# EAGLE design board (EAGLE 7.4.0)
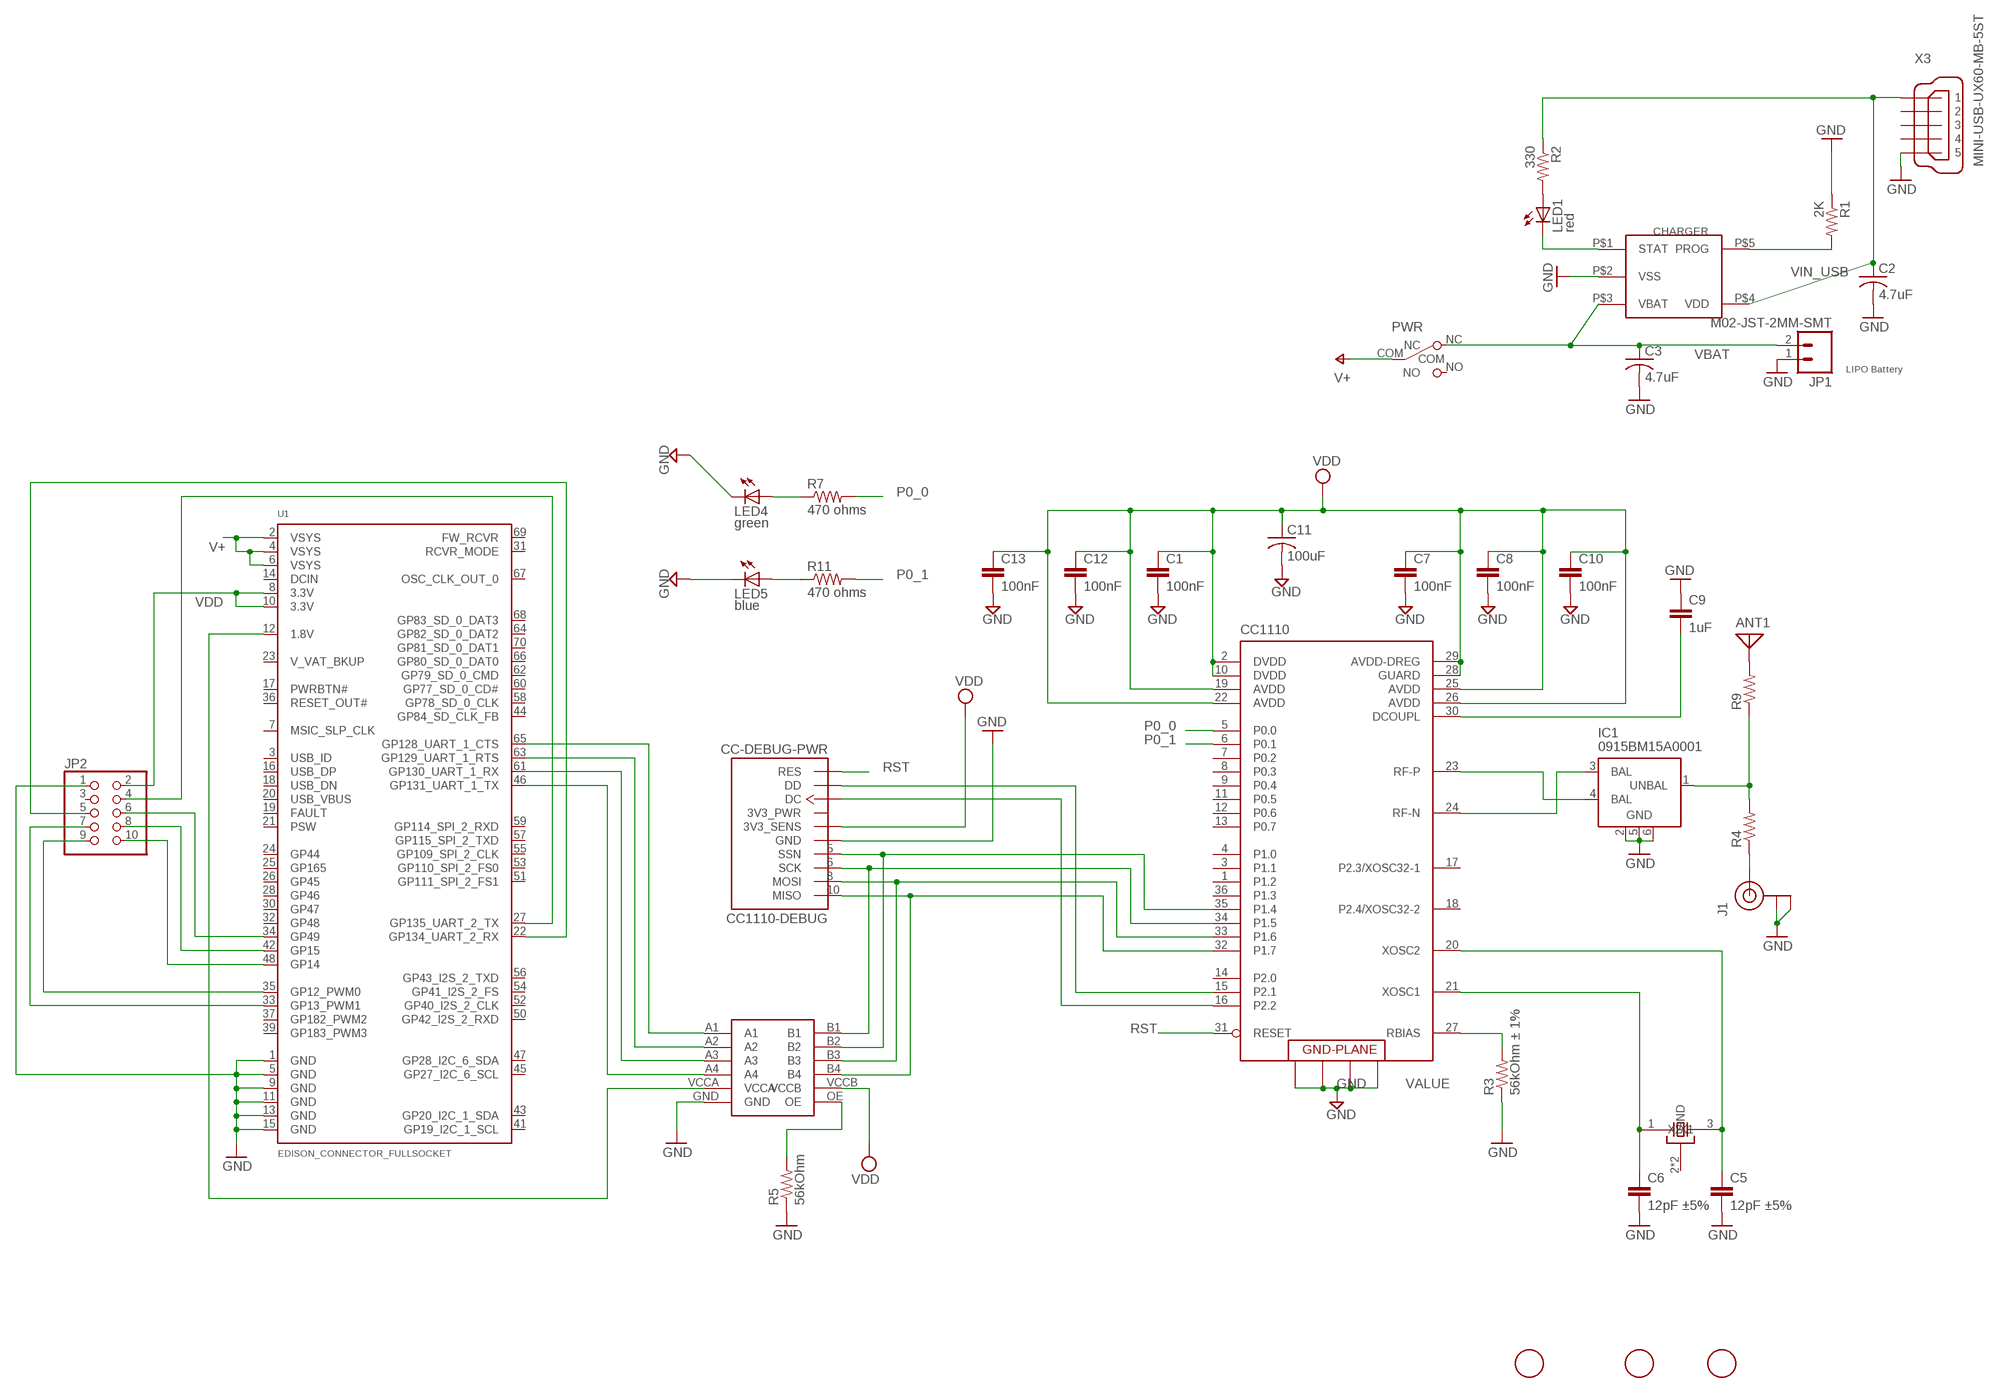
[diagram p0: schematic, sheet 1]

## Parts
ANT1  ANTENNA  [PAD-01]
C1  100nF  C-EUC0402  [C0402]
C2  4.7uF  C-USC0603K  [C0603K]
C3  4.7uF  C-USC0603K  [C0603K]
C5  12pF ±5%  C-EUC0402K  [C0402K]
C6  12pF ±5%  C-EUC0402K  [C0402K]
C7  100nF  C-EUC0402  [C0402]
C8  100nF  C-EUC0402  [C0402]
C9  1uF  C-EUC0402K  [C0402K]
C10  100nF  C-EUC0402  [C0402]
C11  100uF  C-USC0805K  [C0805K]
C12  100nF  C-EUC0402  [C0402]
C13  100nF  C-EUC0402  [C0402]
CC1110  CC1110  [QLP-36_UPDATE]
CC1110-DEBUG  CC-DEBUG-PWR  [CC-P05]
CHARGER  MCP73831  [5PIN_SOT23]
FID1  FIDUCIAL  [FIDUCIAL_1MM]
FID2  FIDUCIAL  [FIDUCIAL_1MM]
FID3  FIDUCIAL  [FIDUCIAL_1MM]
IC1  0915BM15A0001  [0915BM15A0001]
J1  U.FL  [U.FL]
JP1  M02-JST-2MM-SMT  [JST-2-SMD]
JP2  PINHD-2X5  [2X05]
LED1  red  LEDSML0603  [SML0603]
LED4  green  LEDSML0603  [SML0603]
LED5  blue  LEDSML0603  [SML0603]
PWR  SW_SLIDE  [SLIDE_SWITCH_SMD]
R1  2K  R-US_R0402  [R0402]
R2  330  R-US_R0402  [R0402]
R3  56kOhm ± 1%  R-US_R0402  [R0402]
R4  R-US_R0402  [R0402]
R5  56kOhm  R-US_R0402  [R0402]
R7  470 ohms  R-US_R0402  [R0402]
R9  R-US_R0402  [R0402]
R11  470 ohms  R-US_R0402  [R0402]
U1  EDISON_CONNECTOR_FULLSOCKET  [DF40-XC-(X.X)-70DS-0.4V(51)]
U$1  TXB0104  [VQFN-N14]
X1  24MHz 8pF 10ppm -20C +70C  CTS_32X25_SMD  [CTS_32X25]
X3  MINI-USB-UX60-MB-5ST  [UX60-MB-5ST]

## Nets
DC: CC1110-DEBUG.3(DC) CC1110.16(P2.2)
DD: CC1110-DEBUG.4(DD) CC1110.15(P2.1)
GND: C1.2 C2.2 C3.2 C5.2 C6.2 C7.2 C8.2 C9.1 C10.2 C11.2 C12.2 C13.2 CC1110-DEBUG.1(GND) CC1110.37(GND) CC1110.38(GND) CC1110.39(GND) CC1110.40(GND) CHARGER.P$2(VSS) IC1.2(GND) IC1.5(GND) IC1.6(GND) J1.P$1(GND) J1.P$2(GND) JP1.1 JP2.1 LED4.C LED5.C R1.1 R3.1 R5.1 U1.1(GND) U1.5(GND) U1.9(GND) U1.11(GND) U1.13(GND) U1.15(GND) U$1.GND X3.5
MISO: CC1110-DEBUG.10(MISO) CC1110.32(P1.7) U$1.B4
MOSI: CC1110-DEBUG.8(MOSI) CC1110.33(P1.6) U$1.B3
N$1: U1.46(GP131_UART_1_TX) U$1.A4
N$2: CHARGER.P$1(STAT) LED1.C
N$3: CHARGER.P$5(PROG) R1.2
N$4: LED1.A R2.2
N$5: CC1110.24(RF-N) IC1.3(BAL)
N$6: U1.61(GP130_UART_1_RX) U$1.A3
N$7: CC1110.23(RF-P) IC1.4(BAL)
N$9: J1.P$3(SIGNAL) R4.1
N$10: IC1.1(UNBAL) R4.2 R9.1
N$11: U1.63(GP129_UART_1_RTS) U$1.A2
N$12: ANT1.1 R9.2
N$13: U1.65(GP128_UART_1_CTS) U$1.A1
N$14: CC1110.27(RBIAS) R3.2
N$15: U1.12(1.8V) U$1.VCCA
N$16: R5.2 U$1.OE
N$17: JP2.9 U1.35(GP12_PWM0)
N$18: C9.2 CC1110.30(DCOUPL)
N$19: JP2.7 U1.33(GP13_PWM1)
N$20: C6.1 CC1110.21(XOSC1) X1.1(X1)
N$21: C5.1 CC1110.20(XOSC2) X1.3(X2)
N$22: JP2.10 U1.48(GP14)
N$23: JP2.8 U1.42(GP15)
N$24: LED4.A R7.1
N$25: LED5.A R11.1
N$26: JP2.6 U1.34(GP49)
N$27: JP2.4 U1.27(GP135_UART_2_TX)
N$28: JP2.5 U1.22(GP134_UART_2_RX)
P0_0: CC1110.5(P0.0) R7.2
P0_1: CC1110.6(P0.1) R11.2
RST: CC1110-DEBUG.7(RES) CC1110.31(RESET)
SCK: CC1110-DEBUG.6(SCK) CC1110.34(P1.5) U$1.B1
SSN: CC1110-DEBUG.5(SSN) CC1110.35(P1.4) U$1.B2
V+: PWR.COM U1.2(VSYS) U1.4(VSYS) U1.6(VSYS)
VBAT: C3.1 CHARGER.P$3(VBAT) JP1.2 PWR.NC
VDD: C1.1 C7.1 C8.1 C10.1 C11.1 C12.1 C13.1 CC1110-DEBUG.2(3V3_SENS) CC1110.2(DVDD) CC1110.10(DVDD) CC1110.19(AVDD) CC1110.22(AVDD) CC1110.25(AVDD) CC1110.26(AVDD) CC1110.28(GUARD) CC1110.29(AVDD-DREG) JP2.2 U1.8(3.3V) U1.10(3.3V) U$1.VCCB
VIN_USB: C2.1 CHARGER.P$4(VDD) R2.1 X3.1
Unconnected: CC1110-DEBUG.9(3V3_PWR) CC1110.1(P1.2) CC1110.3(P1.1) CC1110.4(P1.0) CC1110.7(P0.2) CC1110.8(P0.3) CC1110.9(P0.4) CC1110.11(P0.5) CC1110.12(P0.6) CC1110.13(P0.7) CC1110.14(P2.0) CC1110.17(P2.3/XOSC32-1) CC1110.18(P2.4/XOSC32-2) CC1110.36(P1.3) JP2.3 PWR.NO U1.3(USB_ID) U1.7(MSIC_SLP_CLK) U1.14(DCIN) U1.16(USB_DP) U1.17(PWRBTN#) U1.18(USB_DN) U1.19(FAULT) U1.20(USB_VBUS) U1.21(PSW) U1.23(V_VAT_BKUP) U1.24(GP44) U1.25(GP165) U1.26(GP45) U1.28(GP46) U1.30(GP47) U1.31(RCVR_MODE) U1.32(GP48) U1.36(RESET_OUT#) U1.37(GP182_PWM2) U1.39(GP183_PWM3) U1.41(GP19_I2C_1_SCL) U1.43(GP20_I2C_1_SDA) U1.44(GP84_SD_CLK_FB) U1.45(GP27_I2C_6_SCL) U1.47(GP28_I2C_6_SDA) U1.50(GP42_I2S_2_RXD) U1.51(GP111_SPI_2_FS1) U1.52(GP40_I2S_2_CLK) U1.53(GP110_SPI_2_FS0) U1.54(GP41_I2S_2_FS) U1.55(GP109_SPI_2_CLK) U1.56(GP43_I2S_2_TXD) U1.57(GP115_SPI_2_TXD) U1.58(GP78_SD_0_CLK) U1.59(GP114_SPI_2_RXD) U1.60(GP77_SD_0_CD#) U1.62(GP79_SD_0_CMD) U1.64(GP82_SD_0_DAT2) U1.66(GP80_SD_0_DAT0) U1.67(OSC_CLK_OUT_0) U1.68(GP83_SD_0_DAT3) U1.69(FW_RCVR) U1.70(GP81_SD_0_DAT1) X3.2 X3.3 X3.4

## Notes on the sheet
- LIPO Battery

## Power pins joined to a net without a drawn wire
GND: X1.2(GND) X1.4(GND)

## Library data of the parts
ANT1 = discrete:ANTENNA: Antenna
C1 C5-C10 C12 C13 = rcl:C-EU: CAPACITOR
C2 C3 C11 = rcl:C-US: CAPACITOR, American symbol
CC1110 = parts:CC1110: True System-on-Chip with Low Power RF Transceiver and 8051 MCU
CC1110-DEBUG = parts:CC-DEBUG-PWR: CC debugger connection with various form factors. 2x5-pin 0.05" pitch header include Pin 9 (VDD) supply connection as separate pin. https://github.com/jrowberg/sf-oshw Last updated 2014-01-04 by Jeff Rowberg <jeff@rowberg.net>
CHARGER = parts:MCP73831: Digikey No:- __MCP73831T-2ACI/OTCT-ND__
FID1-FID3 = adafruit:FIDUCIAL: For use by pick and place machines to calibrate the vision/machine, 1mm By microbuilder.eu
IC1 = parts:0915BM15A0001: 915 MHz Impedance Matched Balun-Filter For TI CC11xx Chipset family Data sheet <http://www.johansontechnology.com/datasheets/chipset-specific/0915BM15A0001.pdf>
J1 = SparkFun-Connectors:U.FL: SMD antenna connector- WRL-09144; PROD_ID: CONN-09193
JP1 = SparkFun-Connectors:M02: Standard 2-pin 0.1" header. Use with - straight break away headers ( PRT-00116) - right angle break away headers (PRT-00553) - swiss pins (PRT-00743) - machine pins (PRT-00117) - female headers (PRT-00115) Molex polarized connector foot print use with: PRT-08233 with associated crimp pins and housings. 2.54_SCREWTERM for use with PRT-10571. 3.5mm Screw Terminal footprints for PRT-08084 5mm Screw Terminal footprints for use with PRT-08432; PROD_ID: CONN-08352
JP2 = pinhead:PINHD-2X5: PIN HEADER
LED1 LED4 LED5 = led:LED: LED OSRAM: - CHIPLED LG R971, LG N971, LY N971, LG Q971, LY Q971, LO R971, LY R971 LH N974, LH R974 LS Q976, LO Q976, LY Q976 LO Q996 - Hyper CHIPLED LW Q18S LB Q993, LB Q99A, LB R99A - SideLED LS A670, LO A670, LY A670, LG A670, LP A670 LB A673, LV A673, LT A673, LW A673 LH A674 LY A675 LS A676, LA A676, LO A676, LY A676, LW A676 LS A679, LY A679, LG A679 - Hyper Micro SIDELED® LS Y876, LA Y876, LO Y876, LY Y876 LT Y87S - SmartLED LW L88C, LW L88S LB L89C, LB L89S, LG L890 LS L89K, LO L89K, LY L89K LS L896, LA L896, LO L896, LY L896 - TOPLED LS T670, LO T670, LY T670, LG T670, LP T670 LSG T670, LSP T670, LSY T670, LOP T670, LYG T670 LG T671, LOG T671, LSG T671 LB T673, LV T673, LT T673, LW T673 LH T674 LS T676, LA T676, LO T676, LY T676, LB T676, LH T676, LSB T676, LW T676 LB T67C, LV T67C, LT T67C, LS T67K, LO T67K, LY T67K, LW E67C LS E67B, LA E67B, LO E67B, LY E67B, LB E67C, LV E67C, LT E67C LW T67C LS T679, LY T679, LG T679 LS T770, LO T770, LY T770, LG T770, LP T770 LB T773, LV T773, LT T773, LW T773 LH T774 LS E675, LA E675, LY E675, LS T675 LS T776, LA T776, LO T776, LY T776, LB T776 LHGB T686 LT T68C, LB T68C - Hyper Mini TOPLED® LB M676 - Mini TOPLED Santana® LG M470 LS M47K, LO M47K, LY M47K Source: http://www.osram.convergy.de LUXEON: - LUMILED® LXK2-PW12-R00, LXK2-PW12-S00, LXK2-PW14-U00, LXK2-PW14-V00 LXK2-PM12-R00, LXK2-PM12-S00, LXK2-PM14-U00 LXK2-PE12-Q00, LXK2-PE12-R00, LXK2-PE12-S00, LXK2-PE14-T00, LXK2-PE14-U00 LXK2-PB12-K00, LXK2-PB12-L00, LXK2-PB12-M00, LXK2-PB14-N00, LXK2-PB14-P00, LXK2-PB14-Q00 LXK2-PR12-L00, LXK2-PR12-M00, LXK2-PR14-Q00, LXK2-PR14-R00 LXK2-PD12-Q00, LXK2-PD12-R00, LXK2-PD12-S00 LXK2-PH12-R00, LXK2-PH12-S00 LXK2-PL12-P00, LXK2-PL12-Q00, LXK2-PL12-R00 Source: www.luxeon.com KINGBRIGHT: KA-3528ASYC Source: www.kingbright.com
PWR = parts:SW_SLIDE
R1-R5 R7 R9 R11 = rcl:R-US_: RESISTOR
U1 = Edison:EDISON_CONNECTOR_FULL
U$1 = riled_up_parts:TXB0104
X1 = cts_crystal:CTS_32X25_SMD
X3 = con-hirose:MINI-USB-: MINI USB Connector Source: http://www.hirose.co.jp/cataloge_hp/e24000019.pdf; OC_FARNELL: unknown; OC_NEWARK: unknown

## Board
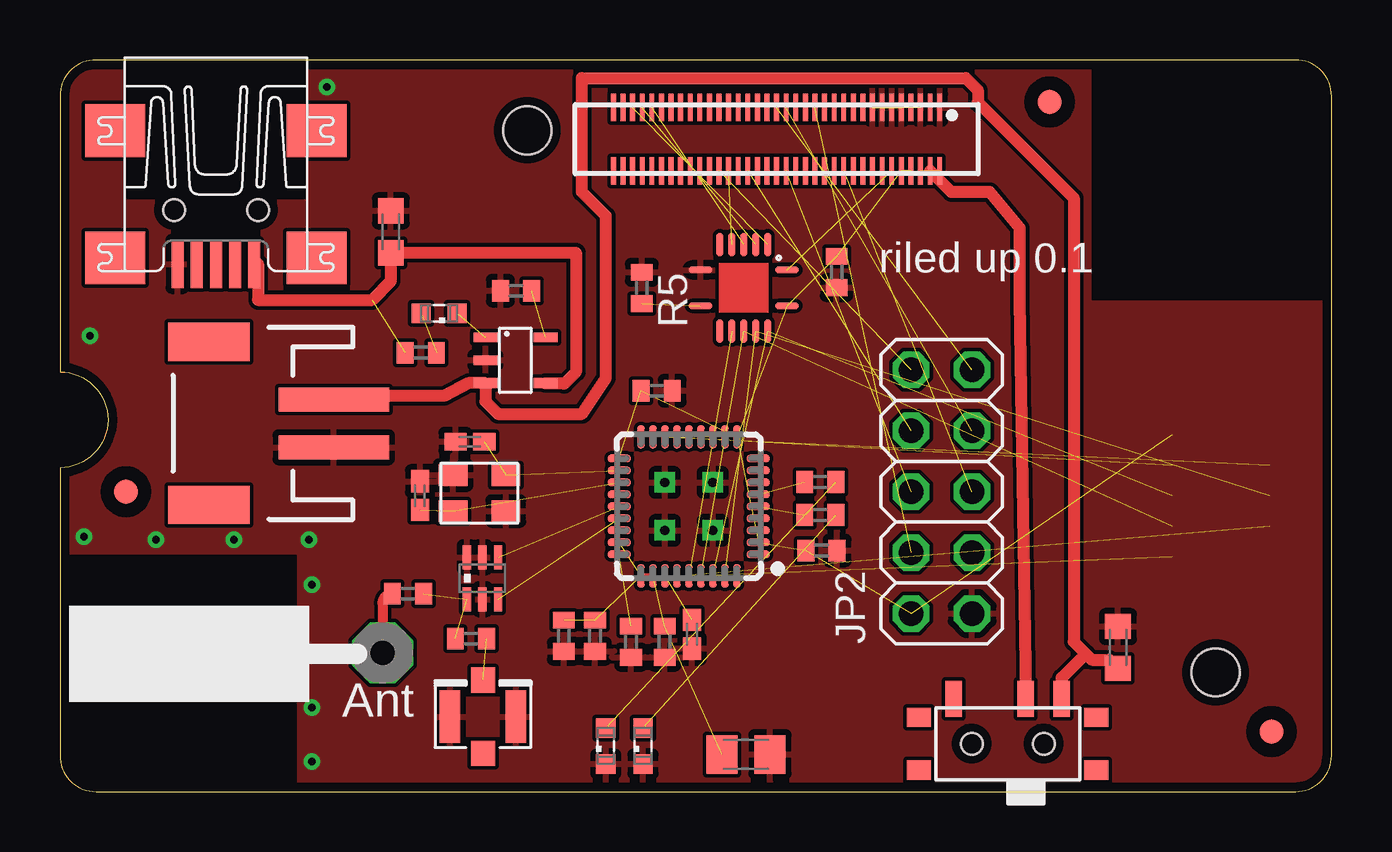
[diagram p1: board, top side]
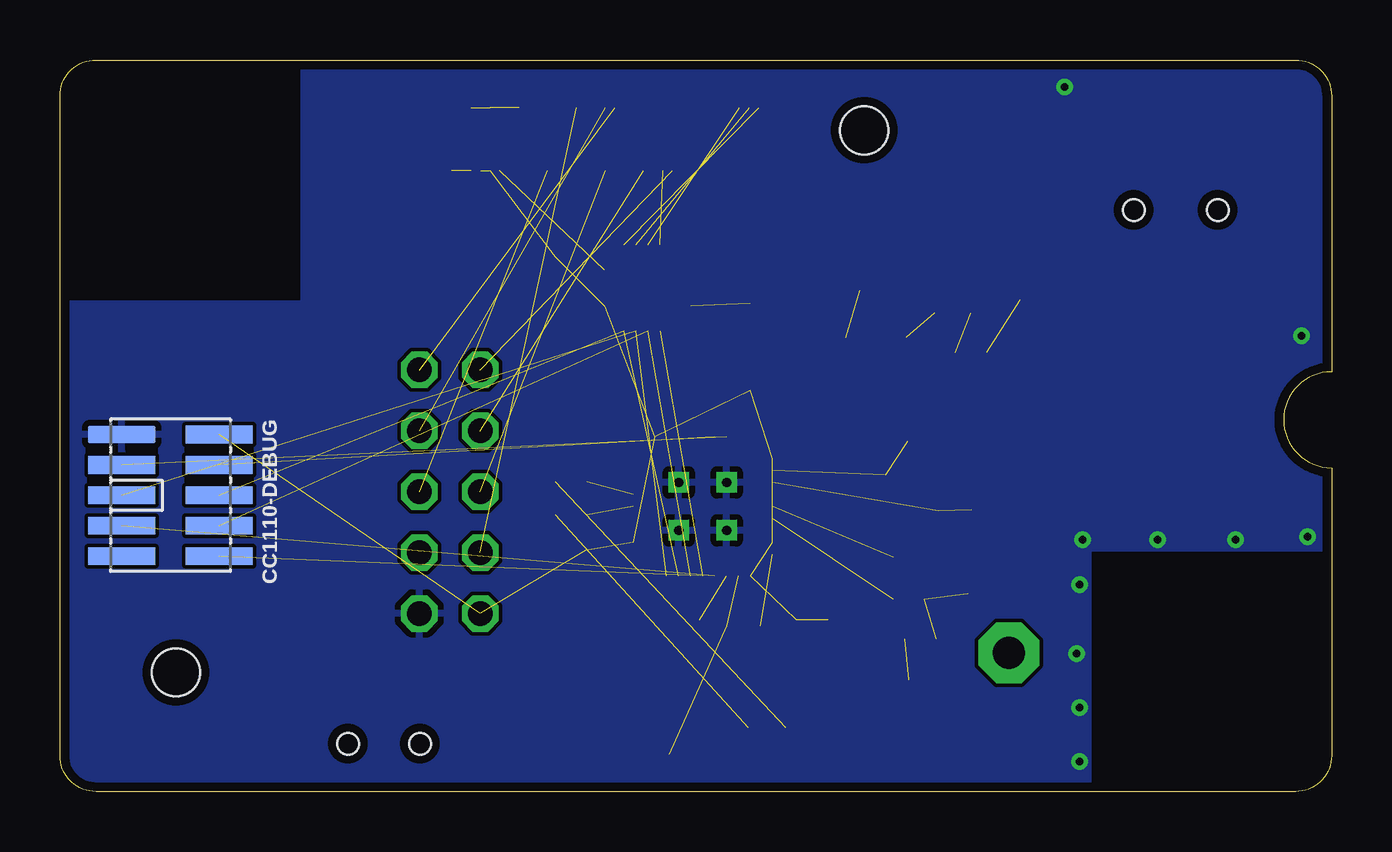
[diagram p2: board, bottom side, seen from below]

Size 53 x 30.5 mm. Coordinates in mm from the lower left corner, seen from the top.
Outline: 0,13.5 0,1.5 arc90 1.5,0 51.5,0 arc90 53,1.5 53,29 arc90 51.5,30.5 1.5,30.5 arc90 0,29 0,17.5 arc-180 0,13.5
Copper layers (1*16): Top 0.0356mm / dielectric 1.5011mm / Bottom 0.0356mm
Design rules "oshpark *": minimum track width 6mil, minimum drill 13mil, track to track 6mil, track to pad 6mil, pad to pad 6mil, via to via 6mil, smd to smd 6mil, copper to edge 15mil, drill to drill 6mil, minimum pad ring 7mil, minimum via ring 7mil, stop-mask expansion 3mil, vias tented up to drill 21mil, thermal gap 10mil
Holes 2 mm at 48.17,4.97 19.48,27.57
tRestrict: area 43,20.5 to 53,30.5
bRestrict: area 0,0 to 10,10; area 43,20.5 to 53,30.5

### Footprints (pad centres in the part's own frame; a part is rotated, then mirrored left to right if it is on the bottom)
PAD-01 = drill 1.321 pad 2.54 octagon: 1 0,0
C0402 = smd 0.7 x 0.9: 1 -0.65,0; 2 0.65,0
C0603K = smd 1.05 x 1.08: 1 -0.875,0; 2 0.875,0
C0402K = smd 0.925 x 0.74: 1 -0.6,0; 2 0.6,0
C0805K = smd 1.3 x 1.6: 1 -1,0; 2 1,0
QLP-36_UPDATE = smd 0.95 x 0.3: 1 -2.9,2; 2 -2.9,1.5; 3 -2.9,1; 4 -2.9,0.5; 5 -2.9,0; 6 -2.9,-0.5; 7 -2.9,-1; 8 -2.9,-1.5; 9 -2.9,-2; 19 2.9,-2; 20 2.9,-1.5; 21 2.9,-1; 22 2.9,-0.5; 23 2.9,0; 24 2.9,0.5; 25 2.9,1; 26 2.9,1.5; 27 2.9,2 | smd 0.3 x 0.95: 10 -2,-2.9; 11 -1.5,-2.9; 12 -1,-2.9; 13 -0.5,-2.9; 14 0,-2.9; 15 0.5,-2.9; 16 1,-2.9; 17 1.5,-2.9; 18 2,-2.9; 28 2,2.9; 29 1.5,2.9; 30 1,2.9; 31 0.5,2.9; 32 0,2.9; 33 -0.5,2.9; 34 -1,2.9; 35 -1.5,2.9; 36 -2,2.9 | drill 0.381 pad 0.85 square: 37 -1,1; 38 1,1; 39 -1,-1; 40 1,-1
CC-P05 = smd 0.74 x 2.8: 1 -2.54,-2.03; 2 -2.54,2.03; 3 -1.27,-2.03; 4 -1.27,2.03; 5 0,-2.03; 6 0,2.03; 7 1.27,-2.03; 8 1.27,2.03; 9 2.54,-2.03; 10 2.54,2.03
5PIN_SOT23 = smd 0.4 x 1: P$1 0.4,-0.63; P$2 1.35,-0.63; P$3 2.3,-0.63; P$4 2.3,1.87; P$5 0.4,1.87
FIDUCIAL_1MM = smd 1 x 1: 1 0,0
0915BM15A0001 = smd 0.35 x 1: 1 -0.65,-0.875; 2 0,-0.875; 3 0.65,-0.875; 4 0.65,0.875; 5 0,0.875; 6 -0.65,0.875
U.FL = smd 2.2 x 0.85: P$1 0,1.375; P$2 0,-1.375 | smd 1.05 x 1: P$3 1.525,0; P$4 -1.525,0
JST-2-SMD = smd 1 x 4.6: 1 -1,-3.7; 2 1,-3.7 | smd 1.6 x 3.4: NC1 -3.4,1.5; NC2 3.4,1.5
2X05 = drill 1.016 octagon: 1 -5.08,-1.27; 2 -5.08,1.27; 3 -2.54,-1.27; 4 -2.54,1.27; 5 0,-1.27; 6 0,1.27; 7 2.54,-1.27; 8 2.54,1.27; 9 5.08,-1.27; 10 5.08,1.27
SML0603 = smd 0.8 x 0.8: A 0.75,0; C -0.75,0
SLIDE_SWITCH_SMD = smd 0.7 x 1.5: COM 0.75,1.875; NC 2.25,1.875; NO -2.25,1.875 | smd 1 x 0.8: P$1 -3.7,-1.1; P$2 -3.7,1.1; P$3 3.7,1.1; P$4 3.7,-1.1 | hole 0.9: -1.5,0; 1.5,0
R0402 = smd 0.7 x 0.9: 1 -0.65,0; 2 0.65,0
DF40-XC-(X.X)-70DS-0.4V(51) = smd 0.2 x 1.14: 1 6.8,1.32; 2 6.8,-1.32; 3 6.4,1.32; 4 6.4,-1.32; 5 6,1.32; 6 6,-1.32; 7 5.6,1.32; 8 5.6,-1.32; 9 5.2,1.32; 10 5.2,-1.32; 11 4.8,1.32; 12 4.8,-1.32; 13 4.4,1.32; 14 4.4,-1.32; 15 4,1.32; 16 4,-1.32; 17 3.6,1.32; 18 3.6,-1.32; 19 3.2,1.32; 20 3.2,-1.32; 21 2.8,1.32; 22 2.8,-1.32; 23 2.4,1.32; 24 2.4,-1.32; 25 2,1.32; 26 2,-1.32; 27 1.6,1.32; 28 1.6,-1.32; 29 1.2,1.32; 30 1.2,-1.32; 31 0.8,1.32; 32 0.8,-1.32; 33 0.4,1.32; 34 0.4,-1.32; 35 0,1.32; 36 0,-1.32; 37 -0.4,1.32; 38 -0.4,-1.32; 39 -0.8,1.32; 40 -0.8,-1.32; 41 -1.2,1.32; 42 -1.2,-1.32; 43 -1.6,1.32; 44 -1.6,-1.32; 45 -2,1.32; 46 -2,-1.32; 47 -2.4,1.32; 48 -2.4,-1.32; 49 -2.8,1.32; 50 -2.8,-1.32; 51 -3.2,1.32; 52 -3.2,-1.32; 53 -3.6,1.32; 54 -3.6,-1.32; 55 -4,1.32; 56 -4,-1.32; 57 -4.4,1.32; 58 -4.4,-1.32; 59 -4.8,1.32; 60 -4.8,-1.32; 61 -5.2,1.32; 62 -5.2,-1.32; 63 -5.6,1.32; 64 -5.6,-1.32; 65 -6,1.32; 66 -6,-1.32; 67 -6.4,1.32; 68 -6.4,-1.32; 69 -6.8,1.32; 70 -6.8,-1.32
VQFN-N14 = smd 0.28 x 1: A1 -1,-1.8; A2 -0.5,-1.8; A3 0,-1.8; A4 0.5,-1.8; B1 -1,1.8; B2 -0.5,1.8; B3 0,1.8; B4 0.5,1.8; NC 1,-1.8; NC2 1,1.8 | smd 1 x 0.28: GND 1.8,-0.75; OE 1.8,0.75; VCCA -1.8,-0.75; VCCB -1.8,0.75
CTS_32X25 = smd 1.2 x 0.9: 1 -1.1,-0.7; 2 1.1,-0.7; 3 1.1,0.8; 4 -1.1,0.8
UX60-MB-5ST = smd 2 x 0.5: 1 2.25,1.6; 2 2.25,0.8; 3 2.25,0; 4 2.25,-0.8; 5 2.25,-1.6 | smd 2.2 x 2.5: M1 -3.3,-4.2; M2 -3.3,4.2; M3 2,4.2; M4 2,-4.2 | hole 0.9: 0,-1.75; 0,1.75

### Placement (x,y rotation side)
ANT1  13.45,5.78 0 top
C1  31.74,10.05 0 top
C2  13.79,23.34 90 top
C3  44.1,6 90 top
C5  17.09,14.59 180 top
C6  15.01,12.34 90 top
C7  25.2,6.25 270 top
C8  21,6.5 270 top
C9  26.34,6.56 90 top
C10  22.3,6.5 270 top
C11  28.59,1.55 0 top
C12  32.37,21.66 270 top
C13  24.87,16.71 0 top
CC1110  26.21,11.89 180 top
CC1110-DEBUG  48.4,12.35 270 bottom
CHARGER  18.36,19.33 270 top
FID1  41.25,28.75 0 top
FID2  2.75,12.5 0 top
FID3  50.5,2.5 0 top
IC1  17.61,8.89 0 top
J1  17.62,3.12 90 top
JP1  7.71,15.35 90 top
JP2  36.75,12.5 90 top
LED1  15.8,19.94 180 top
LED4  24.3,1.9 90 top
LED5  22.75,1.9 90 top
PWR  39.5,2 0 top
R1  19.01,20.88 0 top
R2  15.04,18.3 0 top
R3  23.8,6.25 90 top
R4  17.12,6.38 180 top
R5  24.25,21 270 top
R7  31.69,11.53 180 top
R9  14.5,8.25 180 top
R11  31.69,12.9 180 top
U1  29.87,27.2 0 top
U$1  28.5,21 180 top
X1  17.48,12.39 0 top
X3  6.5,24.25 270 top

### Tracks (layer width: path | path; a pad name or v marks a point on that pad's centre or on a via)
DC  (1 unrouted)
DD  (1 unrouted)
GND  (via drill 0.33 pad 0.41)  (4 unrouted)
  other vias: 4,10.5 10.62,5.75 10.5,8.62 10.5,3.5 1.25,19 1,10.62 7.25,10.5 11.12,29.38 10.5,1.25 10.38,10.5
  pour Bottom: 0,30.5 53,30.5 53,0 0,0
  pour Top: 10,0 10,10 0,10 0,30.5 53,30.5 53,0
MISO  (2 unrouted)
MOSI  (2 unrouted)
N$1  (1 unrouted)
N$2  (1 unrouted)
N$3  (1 unrouted)
N$4  (1 unrouted)
N$5  (1 unrouted)
N$6  (1 unrouted)
N$7  (1 unrouted)
N$9  (1 unrouted)
N$10  (2 unrouted)
N$11  (1 unrouted)
N$12
  Top 0.406: R9.2 arc90 13.45,7.84 ANT1.1
N$13  (1 unrouted)
N$14  (1 unrouted)
N$15  (1 unrouted)
N$16  (1 unrouted)
N$17  (1 unrouted)
N$18  (1 unrouted)
N$19  (1 unrouted)
N$20  (2 unrouted)
N$21  (2 unrouted)
N$22  (1 unrouted)
N$23  (1 unrouted)
N$24  (1 unrouted)
N$25  (1 unrouted)
N$26  (1 unrouted)
N$27  (1 unrouted)
N$28  (1 unrouted)
P0_0  (1 unrouted)
P0_1  (1 unrouted)
RST  (1 unrouted)
SCK  (2 unrouted)
SSN  (2 unrouted)
V+  (2 unrouted)
  Top 0.5: PWR.COM 40.25,5.25 40,20.5 40,23.5 38.75,25 37.15,25 U1.4
VBAT
  Top 0.5: JP1.2 11.51,16.25 13,16.25 13.25,16.5 16,16.5 17.03,17.03 CHARGER.P$3 17.73,16.27 18.25,15.75 21.75,15.75 22.75,17.25 22.75,24 21.75,25 21.75,29.75 37.75,29.75 38.25,29.25 38.25,28.75 42.25,24.75 42.25,6.25 42.75,5.75 | 42.75,5.75 43,5.5 43.73,5.5 C3.1 | PWR.NC 41.75,4.75 42.75,5.75
VDD  (18 unrouted)
  Top 0.26: CC1110.28 CC1110.29
VIN_USB  (1 unrouted)
  Top 0.5: X3.1 8.25,22 8.25,20.5 13,20.5 13.79,21.29 C2.1 21.5,22.46 21.5,17.5 21,17 20.97,17.03 CHARGER.P$4

### Text on the board
tNames: riled up 0.1 | Ant